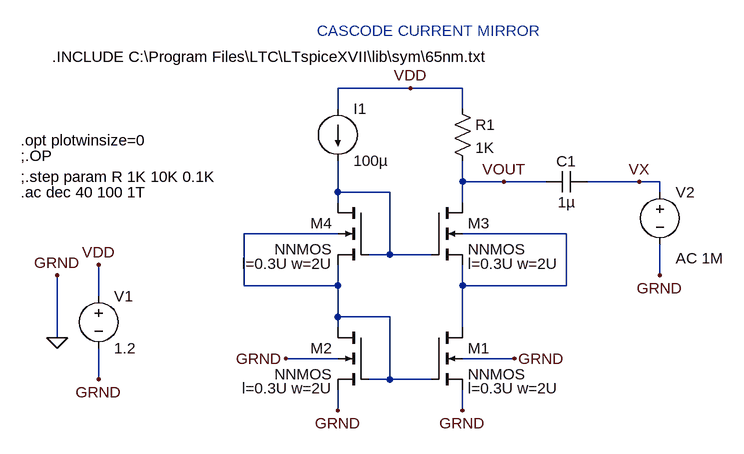
[diagram p0: schematic 14CASCODE CURRENT MIRROR NMOS.asc]
14CASCODE CURRENT MIRROR NMOS.asc, the LTspice schematic file:
Version 4
SHEET 1 880 680
WIRE 32 -144 -80 -144
WIRE 112 -144 32 -144
WIRE -80 -112 -80 -144
WIRE 112 -112 112 -144
WIRE 112 0 112 -32
WIRE 176 0 112 0
WIRE 240 0 176 0
WIRE 384 0 304 0
WIRE 416 0 384 0
WIRE -80 16 -80 -32
WIRE 0 16 -80 16
WIRE 416 16 416 0
WIRE -80 32 -80 16
WIRE 112 32 112 0
WIRE -80 80 -224 80
WIRE 272 80 112 80
WIRE 0 112 0 16
WIRE 0 112 -32 112
WIRE 64 112 0 112
WIRE 416 144 416 96
WIRE -224 160 -224 80
WIRE -80 160 -80 128
WIRE -80 160 -224 160
WIRE 112 160 112 128
WIRE 272 160 272 80
WIRE 272 160 112 160
WIRE -448 176 -448 128
WIRE -80 208 -80 160
WIRE 0 208 -80 208
WIRE -80 224 -80 208
WIRE 112 224 112 160
WIRE -512 240 -512 144
WIRE -80 272 -160 272
WIRE 192 272 112 272
WIRE -448 304 -448 256
WIRE 0 304 0 208
WIRE 0 304 -32 304
WIRE 64 304 0 304
WIRE -80 352 -80 320
WIRE 112 352 112 320
FLAG -512 240 0
FLAG -448 128 VDD
FLAG -512 144 GRND
FLAG -448 304 GRND
FLAG -80 352 GRND
FLAG 112 352 GRND
FLAG -160 272 GRND
FLAG 192 272 GRND
FLAG 416 144 GRND
FLAG 32 -144 VDD
FLAG 384 0 VX
FLAG 176 0 VOUT
SYMBOL nmos4 64 224 R0
WINDOW 123 56 94 Left 2
SYMATTR Value2 l=0.3U w=2U
SYMATTR InstName M1
SYMATTR Value NNMOS
SYMBOL nmos4 -32 224 M0
WINDOW 123 56 94 Left 2
SYMATTR Value2 l=0.3U w=2U
SYMATTR InstName M2
SYMATTR Value NNMOS
SYMBOL voltage -448 160 R0
WINDOW 123 0 0 Left 0
WINDOW 39 0 0 Left 0
SYMATTR InstName V1
SYMATTR Value 1.2
SYMBOL current -80 -112 R0
SYMATTR InstName I1
SYMATTR Value 100µ
SYMBOL res 96 -128 R0
SYMATTR InstName R1
SYMATTR Value 1K
SYMBOL cap 304 -16 R90
WINDOW 0 0 32 VBottom 2
WINDOW 3 32 32 VTop 2
SYMATTR InstName C1
SYMATTR Value 1µ
SYMBOL voltage 416 0 R0
WINDOW 123 24 118 Left 2
WINDOW 39 0 0 Left 0
SYMATTR Value2 AC 1M
SYMATTR InstName V2
SYMATTR Value ""
SYMBOL nmos4 64 32 R0
WINDOW 123 56 94 Left 2
SYMATTR Value2 l=0.3U w=2U
SYMATTR InstName M3
SYMATTR Value NNMOS
SYMBOL nmos4 -32 32 M0
WINDOW 123 56 94 Left 2
SYMATTR Value2 l=0.3U w=2U
SYMATTR InstName M4
SYMATTR Value NNMOS
TEXT -520 -192 Left 2 !.INCLUDE C:\\Program Files\\LTC\\LTspiceXVII\\lib\\sym\\65nm.txt
TEXT -568 -64 Left 2 !.opt plotwinsize=0
TEXT -568 -40 Left 2 !;.OP
TEXT -568 -8 Left 2 !;.step param R 1K 10K 0.1K
TEXT -568 16 Left 2 !.ac dec 40 100 1T
TEXT -112 -232 Left 2 ;CASCODE CURRENT MIRROR

The netlist it stands for:
* 14CASCODE CURRENT MIRROR NMOS.asc
M1 N003 N002 0 0 NNMOS l=0.3U w=2U
M2 N002 N002 0 0 NNMOS l=0.3U w=2U
V1 VDD 0 1.2
I1 VDD N001 100µ
R1 VDD VOUT 1K
C1 VX VOUT 1µ
V2 VX 0 AC 1M
M3 VOUT N001 N003 N003 NNMOS l=0.3U w=2U
M4 N001 N001 N002 N002 NNMOS l=0.3U w=2U
.model NMOS NMOS
.model PMOS PMOS
.lib standard.mos
.INCLUDE C:\Program Files\LTC\LTspiceXVII\lib\sym\65nm.txt
.opt plotwinsize=0
;.OP
;.step param R 1K 10K 0.1K
.ac dec 40 100 1T
* CASCODE CURRENT MIRROR
.backanno
.end